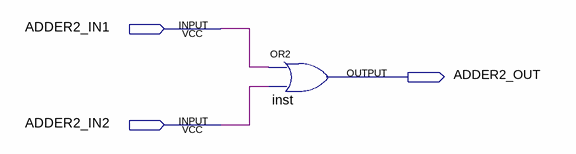
[diagram p0: schematic sheet]
// Quartus schematic ADDER2.bdf as structural Verilog: 1 symbols, 3 pins
module ADDER2 (
  input  ADDER2_IN1,
  input  ADDER2_IN2,
  output ADDER2_OUT
);

  or inst (ADDER2_OUT, ADDER2_IN1, ADDER2_IN2);
endmodule
